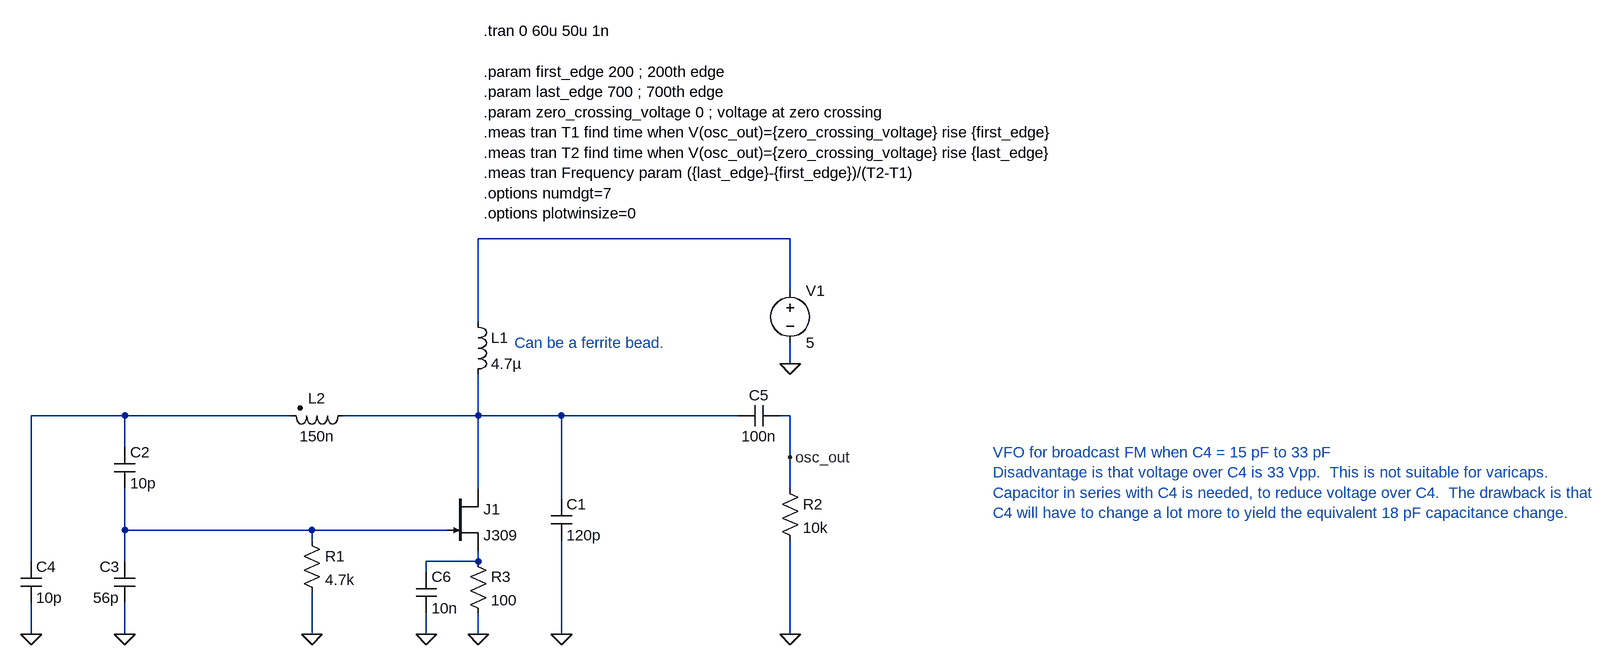
[diagram p0: schematic design3.asc]
design3.asc, the LTspice schematic file:
Version 4
SHEET 1 1232 820
WIRE -80 16 -560 16
WIRE -80 96 -80 16
WIRE -560 144 -560 16
WIRE -80 208 -80 176
WIRE -1104 288 -1248 288
WIRE -848 288 -1104 288
WIRE -560 288 -560 224
WIRE -560 288 -768 288
WIRE -432 288 -560 288
WIRE -160 288 -432 288
WIRE -80 288 -96 288
WIRE -1104 336 -1104 288
WIRE -80 352 -80 288
WIRE -560 400 -560 288
WIRE -80 400 -80 352
WIRE -432 416 -432 288
WIRE -1104 464 -1104 400
WIRE -816 464 -1104 464
WIRE -608 464 -816 464
WIRE -816 480 -816 464
WIRE -1248 512 -1248 288
WIRE -1104 512 -1104 464
WIRE -560 512 -560 496
WIRE -560 512 -640 512
WIRE -640 528 -640 512
WIRE -1248 624 -1248 576
WIRE -1104 624 -1104 576
WIRE -816 624 -816 560
WIRE -640 624 -640 592
WIRE -560 624 -560 592
WIRE -432 624 -432 480
WIRE -80 624 -80 480
FLAG -80 208 0
FLAG -1248 624 0
FLAG -1104 624 0
FLAG -560 624 0
FLAG -816 624 0
FLAG -432 624 0
FLAG -80 624 0
FLAG -80 352 osc_out
FLAG -640 624 0
DATAFLAG -800 464 ""
SYMBOL njf -608 400 R0
SYMATTR InstName J1
SYMATTR Value J309
SYMBOL ind -576 128 R0
SYMATTR InstName L1
SYMATTR Value 4.7µ
SYMATTR SpiceLine Rser=1m
SYMBOL res -832 464 R0
SYMATTR InstName R1
SYMATTR Value 4.7k
SYMBOL cap -1120 336 R0
SYMATTR InstName C2
SYMATTR Value 10p
SYMBOL cap -1088 576 R180
WINDOW 0 24 56 Left 2
WINDOW 3 24 8 Left 2
SYMATTR InstName C3
SYMATTR Value 56p
SYMBOL cap -1264 512 R0
SYMATTR InstName C4
SYMATTR Value 10p
SYMATTR SpiceLine Rpar=1meg
SYMBOL ind2 -752 272 R90
WINDOW 0 5 56 VBottom 2
WINDOW 3 32 56 VTop 2
SYMATTR InstName L2
SYMATTR Value 150n
SYMATTR SpiceLine Rser=0.1
SYMATTR Type ind
SYMBOL voltage -80 80 R0
WINDOW 123 0 0 Left 0
WINDOW 39 0 0 Left 0
SYMATTR InstName V1
SYMATTR Value 5
SYMBOL cap -448 416 R0
SYMATTR InstName C1
SYMATTR Value 120p
SYMBOL res -96 384 R0
SYMATTR InstName R2
SYMATTR Value 10k
SYMBOL cap -96 272 R90
WINDOW 0 0 32 VBottom 2
WINDOW 3 32 32 VTop 2
SYMATTR InstName C5
SYMATTR Value 100n
SYMBOL res -576 496 R0
SYMATTR InstName R3
SYMATTR Value 100
SYMBOL cap -656 528 R0
SYMATTR InstName C6
SYMATTR Value 10n
TEXT -552 -304 Left 2 !.tran 0 60u 50u 1n\n \n.param first_edge 200 ; 200th edge\n.param last_edge 700 ; 700th edge\n.param zero_crossing_voltage 0 ; voltage at zero crossing\n.meas tran T1 find time when V(osc_out)={zero_crossing_voltage} rise {first_edge}\n.meas tran T2 find time when V(osc_out)={zero_crossing_voltage} rise {last_edge}\n.meas tran Frequency param ({last_edge}-{first_edge})/(T2-T1)\n.options numdgt=7\n.options plotwinsize=0
TEXT 232 344 Left 2 ;VFO for broadcast FM when C4 = 15 pF to 33 pF\nDisadvantage is that voltage over C4 is 33 Vpp.  This is not suitable for varicaps.\nCapacitor in series with C4 is needed, to reduce voltage over C4.  The drawback is that\nC4 will have to change a lot more to yield the equivalent 18 pF capacitance change.
TEXT -504 176 Left 2 ;Can be a ferrite bead.

The netlist it stands for:
* design3.asc
J1 N003 N004 N005 J309
L1 N001 N003 4.7µ Rser=1m
R1 N004 0 4.7k
C2 N002 N004 10p
C3 0 N004 56p
C4 N002 0 10p Rpar=1meg
L2 N003 N002 150n Rser=0.1
V1 N001 0 5
C1 N003 0 120p
R2 osc_out 0 10k
C5 osc_out N003 100n
R3 N005 0 100
C6 N005 0 10n
.model NJF NJF
.model PJF PJF
.lib standard.jft
.tran 0 60u 50u 1n
.param first_edge 200 ; 200th edge
.param last_edge 700 ; 700th edge
.param zero_crossing_voltage 0 ; voltage at zero crossing
.meas tran T1 find time when V(osc_out)={zero_crossing_voltage} rise {first_edge}
.meas tran T2 find time when V(osc_out)={zero_crossing_voltage} rise {last_edge}
.meas tran Frequency param ({last_edge}-{first_edge})/(T2-T1)
.options numdgt=7
.options plotwinsize=0
* VFO for broadcast FM when C4 = 15 pF to 33 pF
* Disadvantage is that voltage over C4 is 33 Vpp.  This is not suitable for varicaps.
* Capacitor in series with C4 is needed, to reduce voltage over C4.  The drawback is that
* C4 will have to change a lot more to yield the equivalent 18 pF capacitance change.
* Can be a ferrite bead.
.backanno
.end